# Altium schematic sheet [01] - Processor.SchDoc
size A4
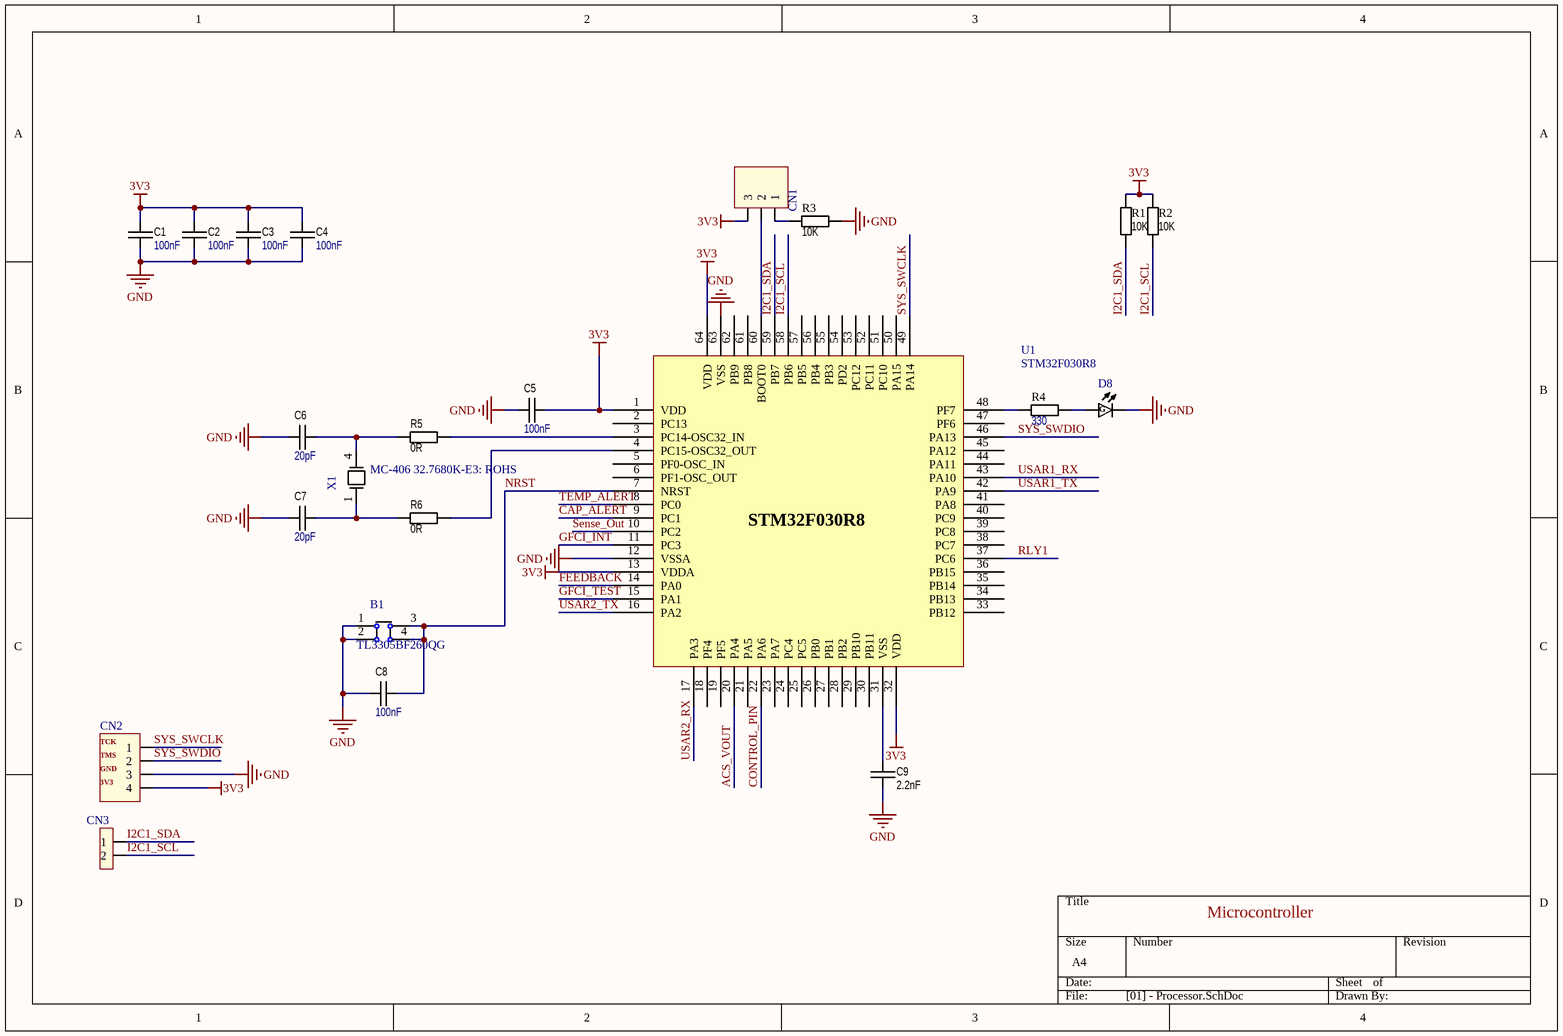
[diagram p0: [01] - Processor.SchDoc]

## Parts
B1  TL3305BF260QG  [Switch]
C1  value 100nF  [CAP 0603/1608]  (hidden comment: CAP CER 1UF 16V X5R 0603)
C2  value 100nF  [CAP 0603/1608]  (hidden comment: CAP CER 1UF 16V X5R 0603)
C3  value 100nF  [CAP 0603/1608]  (hidden comment: CAP CER 1UF 16V X5R 0603)
C4  value 100nF  [CAP 0603/1608]  (hidden comment: CAP CER 1UF 16V X5R 0603)
C5  value 100nF  [CAP 0603/1608]  (hidden comment: CAP CER 1UF 16V X5R 0603)
C6  value 20pF  [CAP 0603/1608]  (hidden comment: CAPC_20pF_0603_50V)
C7  value 20pF  [CAP 0603/1608]  (hidden comment: CAPC_20pF_0603_50V)
C8  value 100nF  [CAP 0603/1608]  (hidden comment: CAP CER 1UF 16V X5R 0603)
C9  value 2.2nF  [CAP 0603/1608]  (hidden comment: C0603C222K5RACTU)
CN1  87220-3  [Terminal_3]  (value not drawn)  (no BOM)
CN2  61300411121  [Terminal_4]  (value not drawn)  (no BOM)
CN3  5-146280-2  [Terminal_2]  (value not drawn)  (no BOM)
D8  SML-D12M8WT86  [LED-0603]  (value not drawn)
R1  value 10K  [R0603]  (hidden comment: ESR03EZPF1002)
R2  value 10K  [R0603]  (hidden comment: ESR03EZPF1002)
R3  value 10K  [R0603]  (hidden comment: ESR03EZPF1002)
R4  value 330  [R0603]  (hidden comment: RES SMD 330 OHM 1% 1/10W 060)
R5  value 0R  [R0603]  (hidden comment: RES 0R 0603 JUMPER)
R6  value 0R  [R0603]  (hidden comment: RES 0R 0603 JUMPER)
U1  STM32F030R8  [STM-LQFP64]
X1  MC-406 32.7680K-E3: ROHS  [XTAL_ABS25-32.768KHZ-6-T]

## Nets
3V3: C1.1 C2.1 C3.1 C4.1 C5.2 CN1.3 CN2.4 R1.1 R2.1 U1.1(VDD) U1.13(VDDA) U1.32(VDD) U1.64(VDD)
GND: B1.1 B1.2 C1.2 C2.2 C3.2 C4.2 C5.1 C6.1 C7.1 C8.1 C9.2 CN2.3 D8.1 R3.1 U1.12(VSSA) U1.63(VSS)
ACS_VOUT: U1.20(PA4)
CAP_ALERT: U1.9(PC1)
CONTROL_PIN: U1.22(PA6)
FEEDBACK: U1.14(PA0)
GFCI_INT: U1.11(PC3)
GFCI_TEST: U1.15(PA1)
I2C1_SCL: CN3.2 R2.2 U1.58(PB6)
I2C1_SDA: CN3.1 R1.2 U1.59(PB7)
NRST: B1.3 B1.4 C8.2 U1.7(NRST)
RLY1: U1.37(PC6)
Sense_Out: U1.10(PC2)
SYS_SWCLK: CN2.1 U1.49(PA14)
SYS_SWDIO: CN2.2 U1.46(PA13)
TEMP_ALERT: U1.8(PC0)
USAR1_RX: U1.43(PA10)
USAR1_TX: U1.42(PA9)
USAR2_RX: U1.17(PA3)
USAR2_TX: U1.16(PA2)
NetC6_2: C6.2 R5.1 X1.4
NetC7_2: C7.2 R6.1 X1.1
NetC9_1: C9.1 U1.31(VSS)
NetCN1_1: CN1.1 R3.2
NetCN1_2: CN1.2 U1.60(BOOT0)
NetD8_2: D8.2 R4.2
NetR4_1: R4.1 U1.48(PF7)
NetR5_2: R5.2 U1.3(PC14-OSC32_IN)
NetR6_2: R6.2 U1.4(PC15-OSC32_OUT)

Not connected (* = marked no-connect by the designer): U1 2(PC13) 5(PF0-OSC_IN) 6(PF1-OSC_OUT) 18(PF4) 19(PF5) 21(PA5) 23(PA7) 24(PC4) 25(PC5) 26(PB0) 27(PB1) 28(PB2) 29(PB10) 30(PB11) 33(PB12) 34(PB13) 35(PB14) 36(PB15) 38(PC7) 39(PC8) 40(PC9) 41(PA8) 44(PA11) 45(PA12) 47(PF6) 50(PA15) 51(PC10) 52(PC11) 53(PC12) 54(PD2) 55(PB3) 56(PB4) 57(PB5) 61(PB8) 62(PB9)

## Notes on the sheet
- (near CN2) TCK
- (near CN2) TMS
- (near CN2) GND
- (near CN2) 3V3
- Microcontroller
- (in symbol LED_GREEN) G

## Library data of the parts
B1 = SWITCH: Tactile Switch SPST-NO Top Actuated Surface Mount; Manufacturer: E-Switch; Alternative: *; PartNumber: TL3305BF260QG; Price1: 0.22000; Value: *; Price10: 0.21400; Type: TH; Price100: 0.18790; Footprint: =footprintt; Link: https://www.digikey.com/product-detail/en/e-switch/TL3305BF260QG/EG5354CT-ND/5816199
C1-C5 C8 = CAPC_100NF_0603_50V: 1µF ±10% 16V Ceramic Capacitor X5R 0603 (1608 Metric) /; PartNumber: CC0603KRX5R7BB105; Manufacturer: Yageo; Type: SMD; Package: 0603 (1608 Metric); Price1: 0.11000; Price1000: 0.02217; Link: https://www.digikey.com/product-detail/en/yageo/CC0603KRX5R7BB105/311-1444-1-ND/2833750; Tolerance: ±10%; Price100: 0.03820; Voltage: 16V; Price10: 0.08100
C6 C7 = CAPC_20pF_0603_50V: PartNumber: CC0603JRNPO9BN200; Manufacturer: Yageo; Type: SMD; Tolerance: ±5%; Voltage: 50V; Package: 0603 (1608 Metric); Price1: 0.10000; Price1000: 0.01152; Link: https://www.digikey.com/product-detail/en/yageo/CC0603JRNPO9BN200/311-1424-1-ND/2833730; Price100: 0.02050; Price10: 0.04600
C9 = CAPC_2.2uF_0603_50V: Manufacturer: KEMET; Type: SMD; Tolerance: ±10%; Voltage: 50V; Package: 0603; PartNumber: C0603C222K5RACTU; Price1: 0.10000; Price1000: 0.01044; Link: https://www.digikey.com/product-detail/en/kemet/C0603C222K5RACTU/399-1085-1-ND/411360; Price100: 0.04200
CN1 = CONN_3POS: Connector Header Through Hole 3 position 0.100" (2.54mm); Manufacturer: TE Connectivity AMP Connectors; Availablity: Available; Alternative: *; Package: 0.100" (2.54mm); Type: THT; Link: https://www.digikey.com/product-detail/en/te-connectivity-amp-connectors/87220-3/A26544-ND/298245; PartNumber: 87220-3; Footprint: =Footprint; Price1: 2.57000; Price10: 2.33000; Price100: 1.99710; Price1000: 1.42653; Value: *
CN2 = CONN_4POS: Connector Header Through Hole 4 position 0.100" (2.54mm); Manufacturer: Wurth Electronics Inc.; Availablity: Available; Alternative: *; Package: 0.100" (2.54mm); Type: THT; Link: https://www.digikey.com/product-detail/en/wurth-electronics-inc/61300411121/732-5317-ND/4846827; PartNumber: 61300411121; Footprint: =Footprint; Price1: 0.18000; Price10: 0.15300; Price100: 0.09600; Price1000: 0.08800; Value: *
CN3 = CONN_2POS: Connector Header Through Hole 2 position 0.100" (2.54mm); Manufacturer: TE Connectivity AMP Connectors; Availablity: Available; Alternative: *; Package: 0.100" (2.54mm); Type: THT; Link: https://www.digikey.com/product-detail/en/te-connectivity-amp-connectors/5-146280-2/A121480-ND/2275896; PartNumber: 5-146280-2; Footprint: =Footprint; Price1: 0.36000; Price10: 0.34500; Price100: 0.24140; Price1000: 0.17240; Value: *
D8 = LED_GREEN: Green 572nm LED Indication - Discrete 2.2V 0603 (1608 Metric); Manufacturer: Rohm Semiconductor; Type: SMD; Alternative: *; Footprint: =Footprint; Link: https://www.digikey.com/product-detail/en/rohm-semiconductor/SML-D12M8WT86/511-1578-1-ND/1641810; Package: 0603 (1608 Metric); PartNumber: SML-D12M8WT86; Availability: Available; Price1: 0.33000; Price10: 0.23900; Price100: 0.11340; Price1000: 0.05922; Value: *
R1-R3 = RES_10K: 10 kOhms ±1% 0.25W, 1/4W Chip Resistor 0603 (1608 Metric) Automotive AEC-Q200, Pulse Withstanding Thick Film; Manufacturer: Rohm Semiconductor; Type: SMD; Package: 0603 (1608 Metric); PartNumber: ESR03EZPF1002; Link: https://www.digikey.com/product-detail/en/rohm-semiconductor/ESR03EZPF1002/RHM10KADCT-ND/1983753; Price1: 0.13000; Price1000: 0.02033; Alternative: *; Footprint: =Footprint; Price10: 0.12000; Price100: 0.04620; Availability: Available
R4 = RES_330_0603_1%: 330 Ohms ±1% 0.1W, 1/10W Chip Resistor 0603 (1608 Metric) Moisture Resistant Thick Film; PartNumber: RC0603FR-07330RL; Manufacturer: Yageo; Type: SMD; Package: 0603; Link: https://www.digikey.com/product-detail/en/yageo/RC0603FR-07330RL/311-330HRCT-ND/730109; Price1: 0.10000; Price1000: 0.00421; Price100: 0.00940; Price10: 0.02300; Tolerance: ±1%
R5 R6 = RES_0R_0603_JUMPER: PartNumber: RC0603JR-070RL; Manufacturer: Yageo; Type: SMT; Package: 0603; Link: https://www.digikey.com/product-detail/en/yageo/RC0603JR-070RL/311-0.0GRTR-ND/726675; Price1: 0.1; Price1000: 0.00396; Price10: 0.022; Price100: 0.0088
U1 = STM32F030R8: ARM® Cortex®-M0 STM32F0 Microcontroller IC 32-Bit 48MHz 64KB (64K x 8) FLASH 64-LQFP (10x10); PartNumber: STM32F030R8T6TR; Manufacturer: STMicroelectronics; ComponentLink1Description: Manufacturer URL; ComponentLink1URL: http://www.st.com/web/en/home.html; ComponentLink2Description: Datasheet; ComponentLink2URL: http://www.st.com/st-web-ui/static/active/en/resource/technical/document/datasheet/DM00088500.pdf; ComponentLink3Description: Package Specification; ComponentLink3URL: http://www.st.com/st-web-ui/static/active/en/resource/technical/document/datasheet/DM00088500.pdf; Alternative: *; Package: 64-LQFP (10x10); Price1000: 1.22426; Price1: 2.06000; Price100: 1.49010; Price10: 1.85400; Type: SMD; Value: *; Link: https://www.digikey.com/product-detail/en/stmicroelectronics/STM32F030R8T6TR/497-17335-1-ND/7804399
X1 = MC-406 32.7680K-E3: ROHS: 32.768kHz ±20ppm Crystal 6pF 35 kOhms 4-SOJ, 2.29mm pitch /; Manufacturer: EPSON; Alternative: *; Package: 4-SOJ; Price100: 0.81510; Type: SMD; Price1: 1.12000; PartNumber: MC-406 32.7680K-E3: ROHS; Price10: 0.98700; Price1000: 0.81510; Value: *; Availability: *; Footprint: =Footprintt; Link: https://www.digikey.com/product-detail/en/epson/MC-406-32.7680K-E3-ROHS/SER4315CT-ND/7932302